# EAGLE design my_dac_amp (EAGLE 6.4)
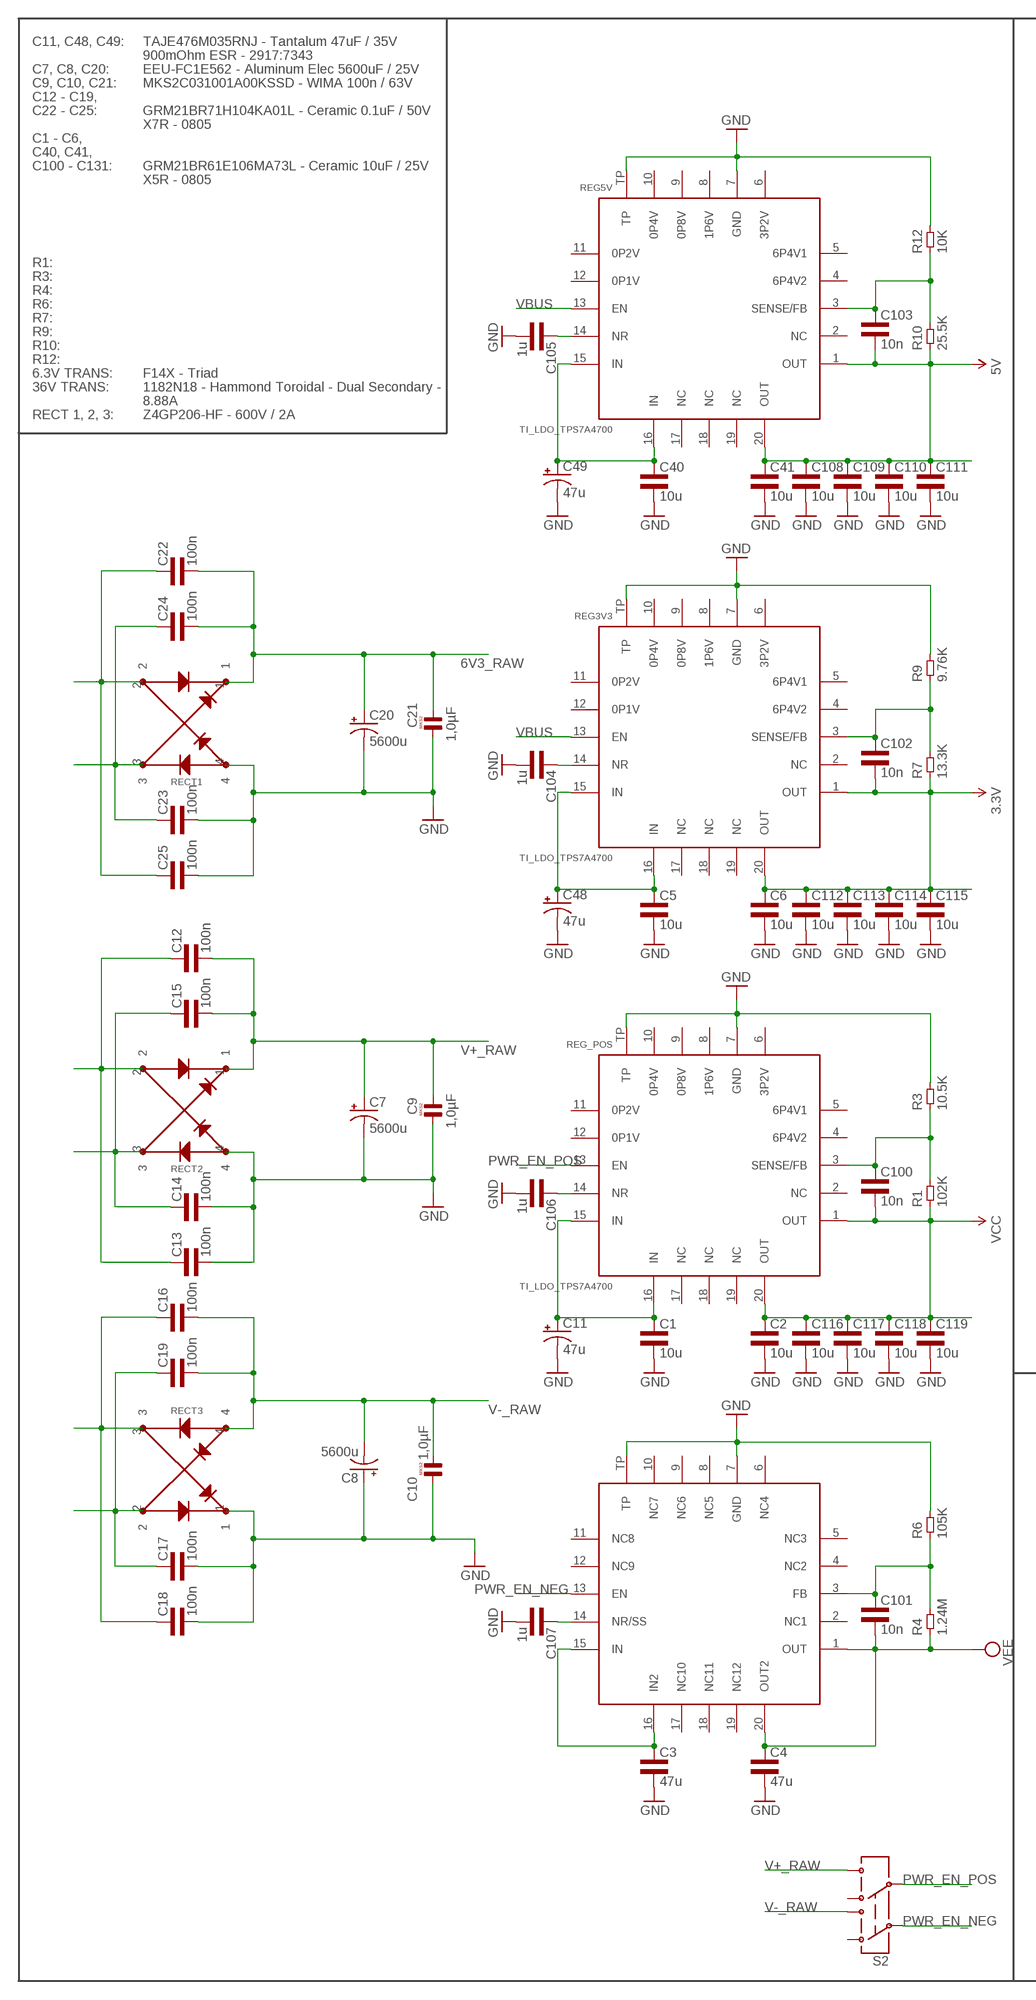
[diagram p0: schematic, sheet 1, part 1 of 2]
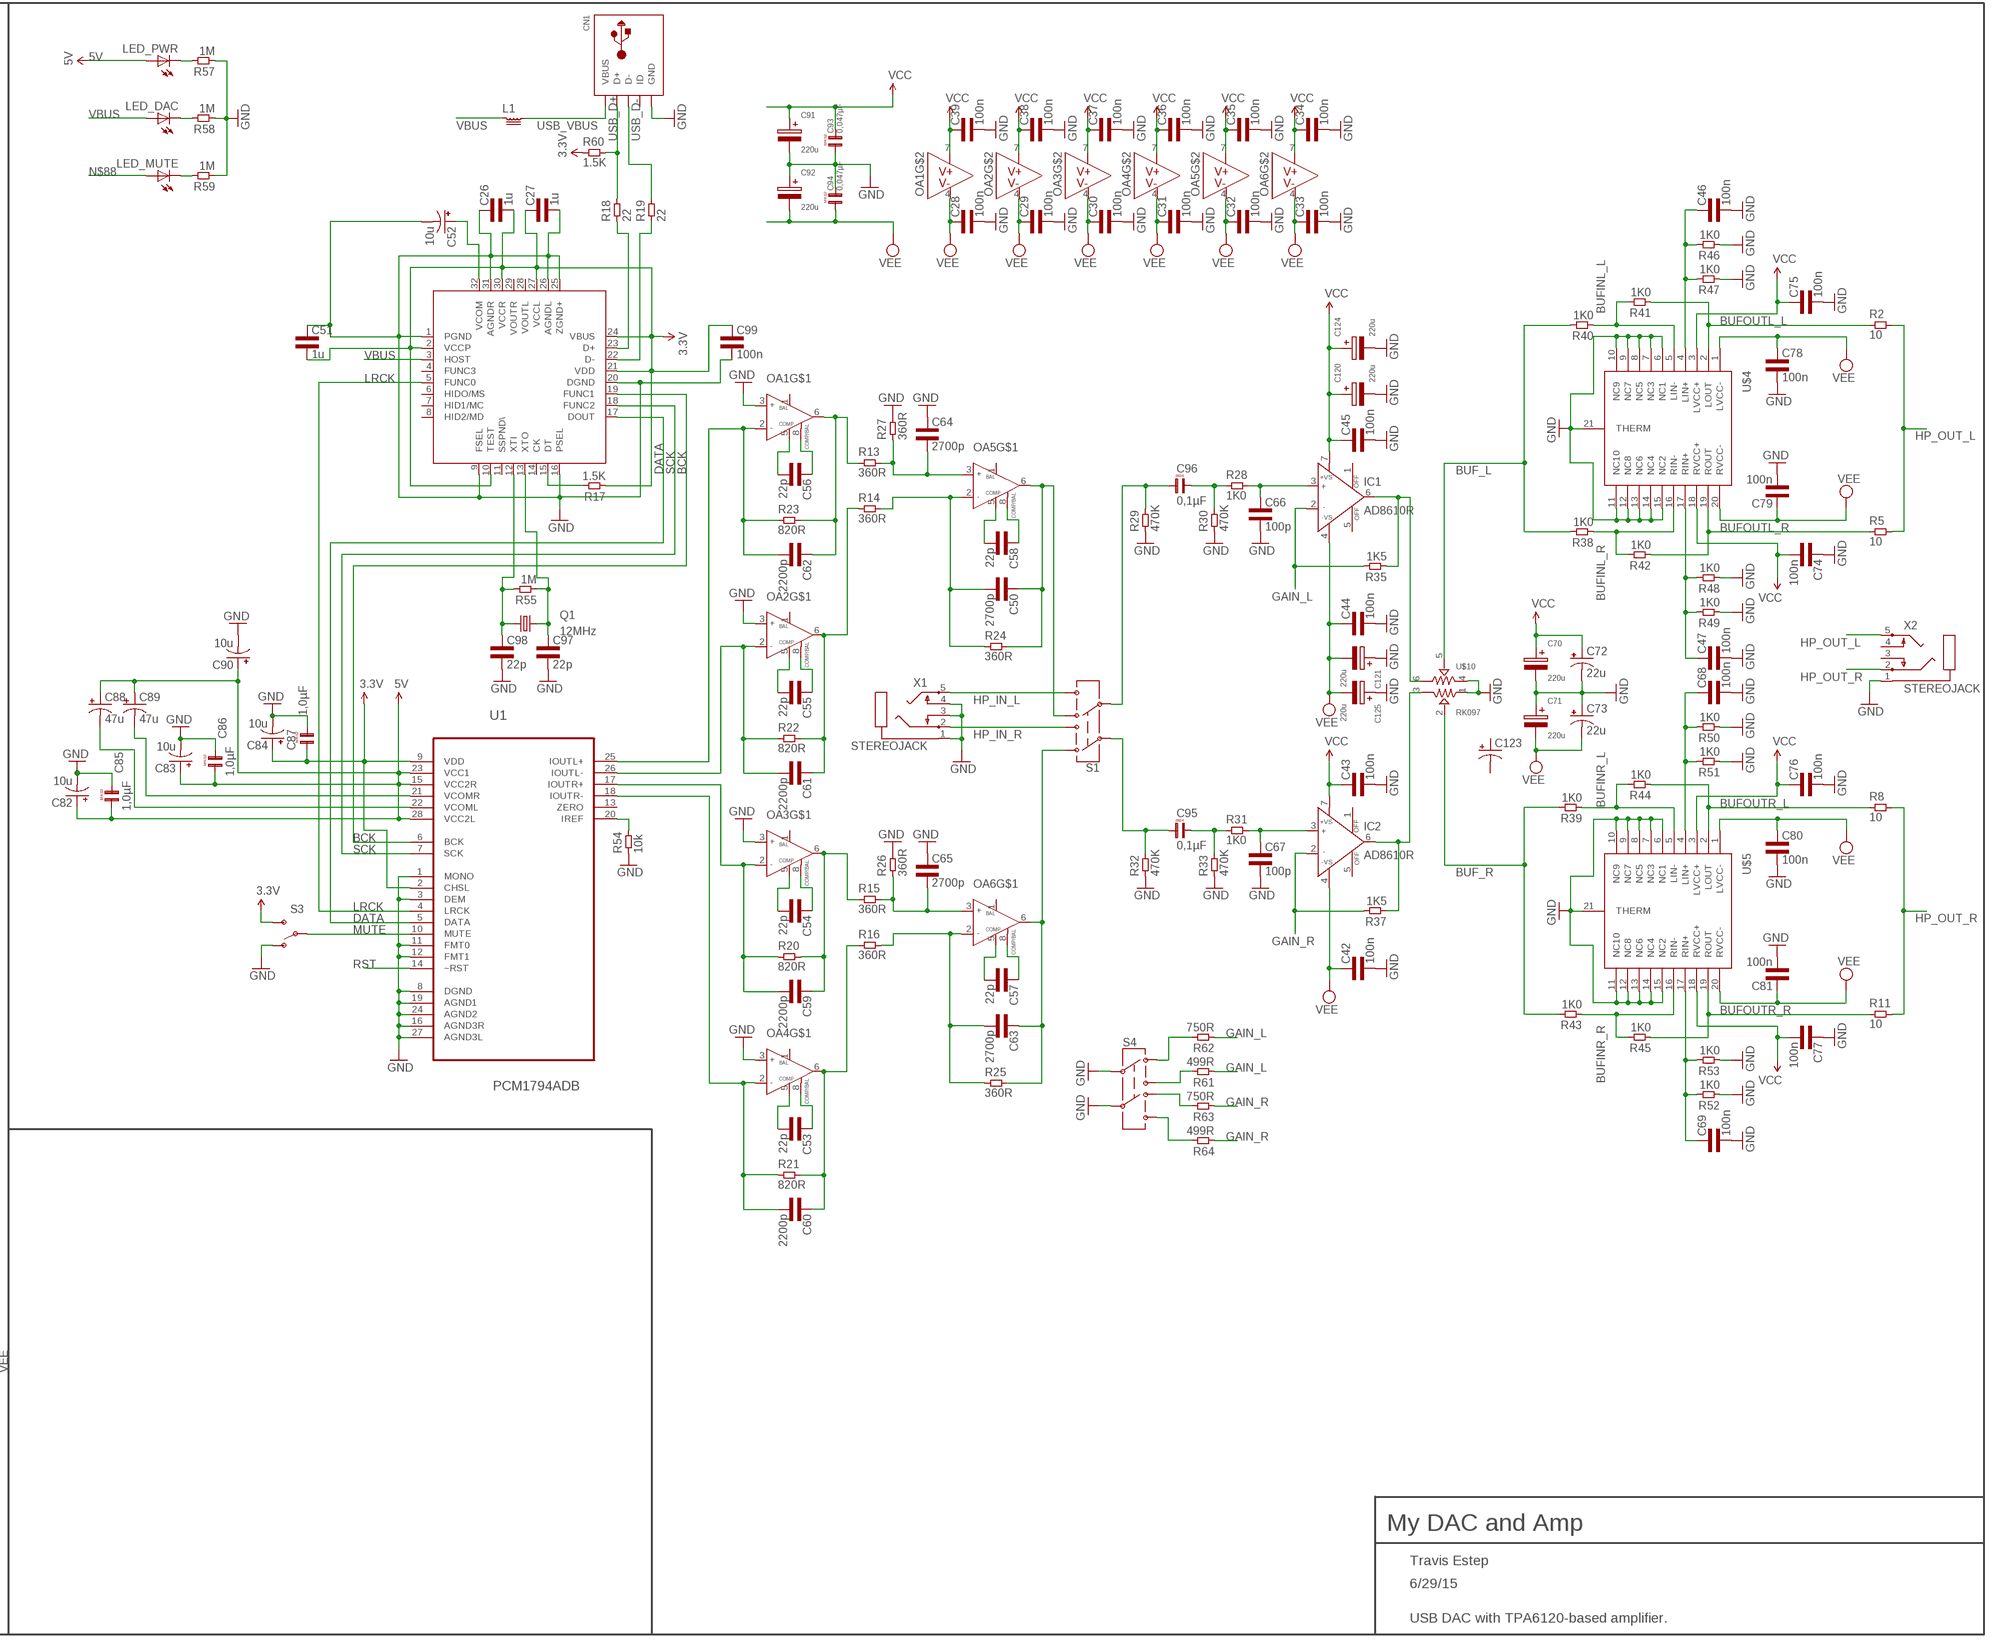
[diagram p1: schematic, sheet 1, part 2 of 2]

## Parts
C1  10u  CAP1206L3  [1206L3]
C2  10u  CAP0805L3  [0805L3]
C3  47u  CAP1206L3  [1206L3]
C4  47u  CAP1206L3  [1206L3]
C5  10u  CAP1206L3  [1206L3]
C6  10u  CAP0805L3  [0805L3]
C7  5600u  CPOL-USE7.5-16  [E7,5-16]
C8  5600u  CPOL-USE7.5-16  [E7,5-16]
C9  1,0µF  [R5B5]
C10  1,0µF  [R5B5]
C11  47u  CPOL-USSMCE  [SMC_E]
C12  100n  CAP0805L3  [0805L3]
C13  100n  CAP0805L3  [0805L3]
C14  100n  CAP0805L3  [0805L3]
C15  100n  CAP0805L3  [0805L3]
C16  100n  CAP0805L3  [0805L3]
C17  100n  CAP0805L3  [0805L3]
C18  100n  CAP0805L3  [0805L3]
C19  100n  CAP0805L3  [0805L3]
C20  5600u  CPOL-USE7.5-16  [E7,5-16]
C21  1,0µF  [R5B5]
C22  100n  CAP0805L3  [0805L3]
C23  100n  CAP0805L3  [0805L3]
C24  100n  CAP0805L3  [0805L3]
C25  100n  CAP0805L3  [0805L3]
C26  1u  CAP0603L3  [0603L3]
C27  1u  CAP0603L3  [0603L3]
C28  100n  CAP0603L3  [0603L3]
C29  100n  CAP0603L3  [0603L3]
C30  100n  CAP0603L3  [0603L3]
C31  100n  CAP0603L3  [0603L3]
C32  100n  CAP0603L3  [0603L3]
C33  100n  CAP0603L3  [0603L3]
C34  100n  CAP0603L3  [0603L3]
C35  100n  CAP0603L3  [0603L3]
C36  100n  CAP0603L3  [0603L3]
C37  100n  CAP0603L3  [0603L3]
C38  100n  CAP0603L3  [0603L3]
C39  100n  CAP0603L3  [0603L3]
C40  10u  CAP1206L3  [1206L3]
C41  10u  CAP0805L3  [0805L3]
C42  100n  CAP0603L3  [0603L3]
C43  100n  CAP0603L3  [0603L3]
C44  100n  CAP0603L3  [0603L3]
C45  100n  CAP0603L3  [0603L3]
C46  100n  CAP0603L3  [0603L3]
C47  100n  CAP0603L3  [0603L3]
C48  47u  CPOL-USSMCE  [SMC_E]
C49  47u  CPOL-USSMCE  [SMC_E]
C50  2700p  CAP0603L3  [0603L3]
C51  1u  CAP0603L3  [0603L3]
C52  10u  CPOL-USE3.5-8  [E3,5-8]
C53  22p  CAP0603L3  [0603L3]
C54  22p  CAP0603L3  [0603L3]
C55  22p  CAP0603L3  [0603L3]
C56  22p  CAP0603L3  [0603L3]
C57  22p  CAP0603L3  [0603L3]
C58  22p  CAP0603L3  [0603L3]
C59  2200p  CAP0603L3  [0603L3]
C60  2200p  CAP0603L3  [0603L3]
C61  2200p  CAP0603L3  [0603L3]
C62  2200p  CAP0603L3  [0603L3]
C63  2700p  CAP0603L3  [0603L3]
C64  2700p  CAP0603L3  [0603L3]
C65  2700p  CAP0603L3  [0603L3]
C66  100p  CAP0603L3  [0603L3]
C67  100p  CAP0603L3  [0603L3]
C68  100n  CAP0603L3  [0603L3]
C69  100n  CAP0603L3  [0603L3]
C70  220u  CAP_POL8066M  [8066M]
C71  220u  CAP_POL8066M  [8066M]
C72  22u  CPOL-USCT6032  [CT6032]
C73  22u  CPOL-USCT6032  [CT6032]
C74  100n  CAP0603L3  [0603L3]
C75  100n  CAP0603L3  [0603L3]
C76  100n  CAP0603L3  [0603L3]
C77  100n  CAP0603L3  [0603L3]
C78  100n  CAP0603L3  [0603L3]
C79  100n  CAP0603L3  [0603L3]
C80  100n  CAP0603L3  [0603L3]
C81  100n  CAP0603L3  [0603L3]
C82  10u  CPOL-USA/3216-18W  [A/3216-18W]
C83  10u  CPOL-USA/3216-18W  [A/3216-18W]
C84  10u  CPOL-USA/3216-18W  [A/3216-18W]
C85  1,0µF  [R5B5]
C86  1,0µF  [R5B5]
C87  1,0µF  [R5B5]
C88  47u  CPOL-USB/3528-21R  [B/3528-21R]
C89  47u  CPOL-USB/3528-21R  [B/3528-21R]
C90  10u  CPOL-USA/3216-18W  [A/3216-18W]
C91  220u  CAP_POL8066M  [8066M]
C92  220u  CAP_POL8066M  [8066M]
C93  0,047µF  [R5B2K5]
C94  0,047µF  [R5B2K5]
C95  0,1µF  [L7,2]
C96  0,1µF  [L7,2]
C97  22p  CAP0603L3  [0603L3]
C98  22p  CAP0603L3  [0603L3]
C99  100n  CAP0603L3  [0603L3]
C100  10n  CAP0603L3  [0603L3]
C101  10n  CAP0603L3  [0603L3]
C102  10n  CAP0603L3  [0603L3]
C103  10n  CAP0603L3  [0603L3]
C104  1u  CAP0603L3  [0603L3]
C105  1u  CAP0603L3  [0603L3]
C106  1u  CAP0603L3  [0603L3]
C107  1u  CAP0603L3  [0603L3]
C108  10u  CAP0805L3  [0805L3]
C109  10u  CAP0805L3  [0805L3]
C110  10u  CAP0805L3  [0805L3]
C111  10u  CAP0805L3  [0805L3]
C112  10u  CAP0805L3  [0805L3]
C113  10u  CAP0805L3  [0805L3]
C114  10u  CAP0805L3  [0805L3]
C115  10u  CAP0805L3  [0805L3]
C116  10u  CAP0805L3  [0805L3]
C117  10u  CAP0805L3  [0805L3]
C118  10u  CAP0805L3  [0805L3]
C119  10u  CAP0805L3  [0805L3]
C120  220u  CAP_POL8066M  [8066M]
C121  220u  CAP_POL8066M  [8066M]
C123  CPOL-USE/7260-38R  [E/7260-38R]
C124  220u  CAP_POL8066M  [8066M]
C125  220u  CAP_POL8066M  [8066M]
CN1  USBMINIB  [USB-MINIB]
IC1  AD8610R  [SO8]
IC2  AD8610R  [SO8]
L1  SRP4020  [4440]
LED_DAC  LED3MM  [LED3MM]
LED_MUTE  LED3MM  [LED3MM]
LED_PWR  LED3MM  [LED3MM]
OA1  NE5534ADSOIC8  [SOIC-8]
OA2  NE5534ADSOIC8  [SOIC-8]
OA3  NE5534ADSOIC8  [SOIC-8]
OA4  NE5534ADSOIC8  [SOIC-8]
OA5  NE5534ADSOIC8  [SOIC-8]
OA6  NE5534ADSOIC8  [SOIC-8]
Q1  12MHz  SPARKFUN_CRYSTALHC49US  [SPARKFUN_HC49US]
R1  102K  RES0603L3  [0603L3]
R2  10  RES1210L3  [1210L3]
R3  10.5K  RES0603L3  [0603L3]
R4  1.24M  RES0603L3  [0603L3]
R5  10  RES1210L3  [1210L3]
R6  105K  RES0603L3  [0603L3]
R7  13.3K  RES0603L3  [0603L3]
R8  10  RES1210L3  [1210L3]
R9  9.76K  RES0603L3  [0603L3]
R10  25.5K  RES0603L3  [0603L3]
R11  10  RES1210L3  [1210L3]
R12  10K  RES0603L3  [0603L3]
R13  360R  RES0603L3  [0603L3]
R14  360R  RES0603L3  [0603L3]
R15  360R  RES0603L3  [0603L3]
R16  360R  RES0603L3  [0603L3]
R17  1.5K  RES0603L3  [0603L3]
R18  22  RES0603L3  [0603L3]
R19  22  RES0603L3  [0603L3]
R20  820R  RES0603L3  [0603L3]
R21  820R  RES0603L3  [0603L3]
R22  820R  RES0603L3  [0603L3]
R23  820R  RES0603L3  [0603L3]
R24  360R  RES0603L3  [0603L3]
R25  360R  RES0603L3  [0603L3]
R26  360R  RES0603L3  [0603L3]
R27  360R  RES0603L3  [0603L3]
R28  1K0  RES0603L3  [0603L3]
R29  470K  RES0603L3  [0603L3]
R30  470K  RES0603L3  [0603L3]
R31  1K0  RES0603L3  [0603L3]
R32  470K  RES0603L3  [0603L3]
R33  470K  RES0603L3  [0603L3]
R35  1K5  RES0603L3  [0603L3]
R37  1K5  RES0603L3  [0603L3]
R38  1K0  RES0603L3  [0603L3]
R39  1K0  RES0603L3  [0603L3]
R40  1K0  RES0603L3  [0603L3]
R41  1K0  RES0603L3  [0603L3]
R42  1K0  RES0603L3  [0603L3]
R43  1K0  RES0603L3  [0603L3]
R44  1K0  RES0603L3  [0603L3]
R45  1K0  RES0603L3  [0603L3]
R46  1K0  RES0603L3  [0603L3]
R47  1K0  RES0603L3  [0603L3]
R48  1K0  RES0603L3  [0603L3]
R49  1K0  RES0603L3  [0603L3]
R50  1K0  RES0603L3  [0603L3]
R51  1K0  RES0603L3  [0603L3]
R52  1K0  RES0603L3  [0603L3]
R53  1K0  RES0603L3  [0603L3]
R54  10k  RES0603L3  [0603L3]
R55  1M  RES0603L3  [0603L3]
R57  1M  RES0603L3  [0603L3]
R58  1M  RES0603L3  [0603L3]
R59  1M  RES0603L3  [0603L3]
R60  1.5K  RES0603L3  [0603L3]
R61  499R  RES0603L3  [0603L3]
R62  750R  RES0603L3  [0603L3]
R63  750R  RES0603L3  [0603L3]
R64  499R  RES0603L3  [0603L3]
RECT1  Z4GP206  [ABS-4]
RECT2  Z4GP206  [ABS-4]
RECT3  Z4GP206  [ABS-4]
REG3V3  TI_LDO_TPS7A4700  [TI_LDO_VQFN-20]
REG5V  TI_LDO_TPS7A4700  [TI_LDO_VQFN-20]
REG_NEG  TI_LDO_TPS7A3301RGWT  [TI_LDO_VQFN-20]
REG_POS  TI_LDO_TPS7A4700  [TI_LDO_VQFN-20]
S1  SWITCH-DPDTOS  [OS]
S2  SWITCH-DPDTOS  [OS]
S3  SWITCH-SPDTKIT  [SWITCH-SPDT_KIT]
S4  SWITCH-DPDTOS  [OS]
U1  PCM1794ADB  [SOP65P780X200-28N]
U$3  PCM2704C_PCM2707  [PCM2704C_PCM2707]
U$4  AMP_TPA6120_TPA6120  [AMP_TPA6120_TPA6120]
U$5  AMP_TPA6120_TPA6120  [AMP_TPA6120_TPA6120]
U$10  RK097  [RK097]
X1  STEREOJACK  [STX3100]
X2  STEREOJACK  [STX3100]

## Nets
3.3V: C6.1 C26.P$2 C27.P$1 C51.P$2 C84.+ C87.1 C99.P$1 C102.P$2 C112.1 C113.1 C114.1 C115.1 R7.P$1 R17.P$1 R60.P$1 REG3V3.1(OUT) REG3V3.20(OUT) S3.3(S) U1.2(CHSL) U1.9(VDD) U$3.2(VCCP) U$3.10(TEST) U$3.21(VDD) U$3.24(VBUS) U$3.27(VCCL) U$3.30(VCCR)
5V: C41.1 C82.+ C83.+ C85.1 C86.1 C88.+ C89.+ C90.+ C103.P$2 C108.1 C109.1 C110.1 C111.1 LED_PWR.A R10.P$1 REG5V.1(OUT) REG5V.20(OUT) U1.15(VCC2R) U1.23(VCC1) U1.28(VCC2L)
6V3_RAW: C5.1 C20.+ C21.2 C22.2 C24.2 C40.1 C48.+ C49.+ RECT1.1 REG3V3.15(IN) REG3V3.16(IN) REG5V.15(IN) REG5V.16(IN)
AMP_CAP_L: C96.P$2 R28.P$1 R30.P$2
AMP_CAP_R: C95.P$2 R31.P$1 R33.P$2
AMP_IN_L: C66.P$1 IC1.3(IN+) R28.P$2
AMP_IN_R: C67.P$1 IC2.3(IN+) R31.P$2
AMP_L: C96.P$1 R29.P$2 S1.5
AMP_OUT_L: IC1.6(OUT) R35.P$1 U$10.6
AMP_OUT_R: IC2.6(OUT) R37.P$1 U$10.3
AMP_R: C95.P$1 R32.P$2 S1.2
BCK: U1.6(BCK) U$3.19(FUNC1)
BUF_L: R38.P$2 R40.P$2 U$10.5
BUF_R: R39.P$2 R43.P$2 U$10.2
BUFINL_L: R40.P$1 R41.P$2 U$4.5(LIN-)
BUFINL_R: R38.P$1 R42.P$2 U$4.16(RIN-)
BUFINR_L: R39.P$1 R44.P$2 U$5.5(LIN-)
BUFINR_R: R43.P$1 R45.P$2 U$5.16(RIN-)
BUFL_L+: C46.P$1 R46.P$2 R47.P$2 U$4.4(LIN+)
BUFL_R+: C47.P$1 R48.P$2 R49.P$2 U$4.17(RIN+)
BUFOUTL_L: R2.P$1 R41.P$1 U$4.2(LOUT)
BUFOUTL_R: R5.P$1 R42.P$1 U$4.19(ROUT)
BUFOUTR_L: R8.P$1 R44.P$1 U$5.2(LOUT)
BUFOUTR_R: R11.P$1 R45.P$1 U$5.19(ROUT)
BUFR_L+: C68.P$1 R50.P$2 R51.P$2 U$5.4(LIN+)
BUFR_R+: C69.P$1 R52.P$2 R53.P$2 U$5.17(RIN+)
D+: R18.P$1 U$3.23(D+)
D-: R19.P$1 U$3.22(D-)
DATA: U1.5(DATA) U$3.17(DOUT)
GAIN_L: IC1.2(IN-) R35.P$2 R61.P$1 R62.P$1
GAIN_R: IC2.2(IN-) R37.P$2 R63.P$1 R64.P$1
GAINL_1: R62.P$2 S4.1
GAINL_2: R61.P$2 S4.3
GAINR_1: R63.P$2 S4.4
GAINR_2: R64.P$2 S4.6
GND: C1.2 C2.2 C3.2 C4.2 C5.2 C6.2 C7.- C8.+ C9.1 C10.1 C11.- C13.2 C14.2 C17.2 C18.2 C20.- C21.1 C23.2 C25.2 C26.P$1 C27.P$2 C28.P$2 C29.P$2 C30.P$2 C31.P$2 C32.P$2 C33.P$2 C34.P$2 C35.P$2 C36.P$2 C37.P$2 C38.P$2 C39.P$2 C40.2 C41.2 C42.P$2 C43.P$2 C44.P$2 C45.P$2 C46.P$2 C47.P$2 C48.- C49.- C51.P$1 C52.- C64.P$1 C65.P$1 C66.P$2 C67.P$2 C68.P$2 C69.P$2 C70.2 C71.1 C72.- C73.+ C74.P$1 C75.P$2 C76.P$2 C77.P$1 C78.P$2 C79.P$2 C80.P$2 C81.P$2 C82.- C83.- C84.- C85.2 C86.2 C87.2 C90.- C91.2 C92.1 C93.1 C94.2 C97.P$2 C98.P$2 C99.P$2 C104.P$2 C105.P$2 C106.P$2 C107.P$2 C108.2 C109.2 C110.2 C111.2 C112.2 C113.2 C114.2 C115.2 C116.2 C117.2 C118.2 C119.2 C120.2 C121.1 C124.2 C125.1 CN1.GND OA1.3(IN+) OA2.3(IN+) OA3.3(IN+) OA4.3(IN+) R3.P$2 R6.P$2 R9.P$2 R12.P$2 R26.P$2 R27.P$2 R29.P$1 R30.P$1 R32.P$1 R33.P$1 R46.P$1 R47.P$1 R48.P$1 R49.P$1 R50.P$1 R51.P$1 R52.P$1 R53.P$1 R54.P$1 R57.P$1 R58.P$1 R59.P$1 RECT1.4 RECT2.4 RECT3.1 REG3V3.7(GND) REG3V3.TP REG5V.7(GND) REG5V.TP REG_NEG.7(GND) REG_NEG.TP REG_POS.7(GND) REG_POS.TP S3.1(O) S4.2 S4.5 U1.1(MONO) U1.3(DEM) U1.8(DGND) U1.11(FMT0) U1.12(FMT1) U1.16(AGND3R) U1.19(AGND1) U1.24(AGND2) U1.27(AGND3L) U$3.1(PGND) U$3.9(FSEL) U$3.16(PSEL) U$3.20(DGND) U$3.25(ZGND+) U$3.26(AGNDL) U$3.31(AGNDR) U$4.6(NC1) U$4.7(NC3) U$4.8(NC5) U$4.9(NC7) U$4.10(NC9) U$4.11(NC10) U$4.12(NC8) U$4.13(NC6) U$4.14(NC4) U$4.15(NC2) U$4.21(THERM) U$5.6(NC1) U$5.7(NC3) U$5.8(NC5) U$5.9(NC7) U$5.10(NC9) U$5.11(NC10) U$5.12(NC8) U$5.13(NC6) U$5.14(NC4) U$5.15(NC2) U$5.21(THERM) U$10.1 U$10.4 X1.1 X1.3 X1.4 X2.1
HP_IN_L: S1.6 X1.5
HP_IN_R: S1.3 X1.2
HP_OUT_L: R2.P$2 R5.P$2 X2.5
HP_OUT_R: R8.P$2 R11.P$2 X2.2
IOUTL+: C62.P$2 OA1.2(IN-) R23.P$1 U1.25(IOUTL+)
IOUTL-: C61.P$2 OA2.2(IN-) R22.P$1 U1.26(IOUTL-)
IOUTR+: C59.P$2 OA3.2(IN-) R20.P$1 U1.17(IOUTR+)
IOUTR-: C60.P$2 OA4.2(IN-) R21.P$1 U1.18(IOUTR-)
IVOUT_L-: C61.P$1 OA2.6(OUT) R14.P$1 R22.P$2
IVOUT_R-: C60.P$1 OA4.6(OUT) R16.P$1 R21.P$2
IVOUTR+: C59.P$1 OA3.6(OUT) R15.P$1 R20.P$2
IVUOT_L+: C62.P$1 OA1.6(OUT) R13.P$1 R23.P$2
LRCK: U1.4(LRCK) U$3.5(FUNC0)
MUTE: S3.2(P) U1.10(MUTE)
N$1: C103.P$1 R10.P$2 R12.P$1 REG5V.3(SENSE/FB)
N$2: C100.P$1 R1.P$2 R3.P$1 REG_POS.3(SENSE/FB)
N$4: LED_PWR.K(C) R57.P$2
N$5: LED_DAC.K(C) R58.P$2
N$7: C101.P$1 R4.P$2 R6.P$1 REG_NEG.3(FB)
N$12: C12.1 C13.1 RECT2.2
N$13: C14.1 C15.1 RECT2.3
N$17: C102.P$1 R7.P$2 R9.P$1 REG3V3.3(SENSE/FB)
N$23: C23.1 C24.1 RECT1.3
N$24: C22.1 C25.1 RECT1.2
N$32: C52.+ U$3.32(VCOM)
N$33: R17.P$2 U$3.15(DT)
N$51: C107.P$1 REG_NEG.14(NR/SS)
N$52: C106.P$1 REG_POS.14(NR)
N$54: C104.P$1 REG3V3.14(NR)
N$55: C105.P$1 REG5V.14(NR)
N$72: C16.1 C18.1 RECT3.3
N$77: C17.1 C19.1 RECT3.2
N$78: C89.- U1.21(VCOMR)
N$79: C88.- U1.22(VCOML)
N$80: C98.P$1 Q1.1 R55.P$2 U$3.12(XTI)
N$82: C97.P$1 Q1.2 R55.P$1 U$3.13(XTO)
N$83: LED_MUTE.K(C) R59.P$2
N$84: R54.P$2 U1.20(IREF)
N$88: LED_MUTE.A
OA1_COMP: C56.P$2 OA1.5(COMP)
OA1_COMPBAL: C56.P$1 OA1.8(COMP/BAL)
OA2_COMP: C55.P$2 OA2.5(COMP)
OA2_COMPBAL: C55.P$1 OA2.8(COMP/BAL)
OA3_COMP: C54.P$2 OA3.5(COMP)
OA3_COMPBAL: C54.P$1 OA3.8(COMP/BAL)
OA4_COMP: C53.P$2 OA4.5(COMP)
OA4_COMPBAL: C53.P$1 OA4.8(COMP/BAL)
OA5_COMP: C58.P$2 OA5.5(COMP)
OA5_COMPBAL: C58.P$1 OA5.8(COMP/BAL)
OA6_COMP: C57.P$2 OA6.5(COMP)
OA6_COMPBAL: C57.P$1 OA6.8(COMP/BAL)
PWR_EN_NEG: REG_NEG.13(EN) S2.2
PWR_EN_POS: REG_POS.13(EN) S2.5
RST: U1.14(~RST)
SCK: U1.7(SCK) U$3.18(FUNC2)
SEIN_L+: C64.P$2 OA5.3(IN+) R13.P$2 R27.P$1
SEIN_L-: C50.P$2 OA5.2(IN-) R14.P$2 R24.P$1
SEIN_R+: C65.P$2 OA6.3(IN+) R15.P$2 R26.P$1
SEIN_R-: C63.P$2 OA6.2(IN-) R16.P$2 R25.P$1
SEOUT_L: C50.P$1 OA5.6(OUT) R24.P$2 S1.4
SEOUT_R: C63.P$1 OA6.6(OUT) R25.P$2 S1.1
USB_D+: CN1.D+ R18.P$2 R60.P$2
USB_D-: CN1.D- R19.P$2
USB_VBUS: CN1.VBUS L1.2
V+_RAW: C1.1 C7.+ C9.2 C11.+ C12.2 C15.2 RECT2.1 REG_POS.15(IN) REG_POS.16(IN) S2.6
V-_RAW: C3.1 C8.- C10.2 C16.2 C19.2 RECT3.4 REG_NEG.15(IN) REG_NEG.16(IN2) S2.3
VBUS: L1.1 LED_DAC.A REG3V3.13(EN) REG5V.13(EN) U$3.3(HOST)
VCC: C2.1 C34.P$1 C35.P$1 C36.P$1 C37.P$1 C38.P$1 C39.P$1 C43.P$1 C45.P$1 C70.1 C72.+ C74.P$2 C75.P$1 C76.P$1 C77.P$2 C91.1 C93.2 C100.P$2 C116.1 C117.1 C118.1 C119.1 C120.1 C124.1 IC1.7(+VS) IC2.7(+VS) OA1.7(V+) OA2.7(V+) OA3.7(V+) OA4.7(V+) OA5.7(V+) OA6.7(V+) R1.P$1 REG_POS.1(OUT) REG_POS.20(OUT) U$4.3(LVCC+) U$4.18(RVCC+) U$5.3(LVCC+) U$5.18(RVCC+)
VEE: C4.1 C28.P$1 C29.P$1 C30.P$1 C31.P$1 C32.P$1 C33.P$1 C42.P$1 C44.P$1 C71.2 C73.- C78.P$1 C79.P$1 C80.P$1 C81.P$1 C92.2 C94.1 C101.P$2 C121.2 C125.2 IC1.4(-VS) IC2.4(-VS) OA1.4(V-) OA2.4(V-) OA3.4(V-) OA4.4(V-) OA5.4(V-) OA6.4(V-) R4.P$1 REG_NEG.1(OUT) REG_NEG.20(OUT2) U$4.1(LVCC-) U$4.20(RVCC-) U$5.1(LVCC-) U$5.20(RVCC-)
Unconnected: C123.+ C123.- CN1.ID IC1.1(OFF) IC1.5(OFF) IC2.1(OFF) IC2.5(OFF) OA1.1(BAL) OA2.1(BAL) OA3.1(BAL) OA4.1(BAL) OA5.1(BAL) OA6.1(BAL) REG3V3.2(NC) REG3V3.4(6P4V2) REG3V3.5(6P4V1) REG3V3.6(3P2V) REG3V3.8(1P6V) REG3V3.9(0P8V) REG3V3.10(0P4V) REG3V3.11(0P2V) REG3V3.12(0P1V) REG3V3.17(NC) REG3V3.18(NC) REG3V3.19(NC) REG5V.2(NC) REG5V.4(6P4V2) REG5V.5(6P4V1) REG5V.6(3P2V) REG5V.8(1P6V) REG5V.9(0P8V) REG5V.10(0P4V) REG5V.11(0P2V) REG5V.12(0P1V) REG5V.17(NC) REG5V.18(NC) REG5V.19(NC) REG_NEG.2(NC1) REG_NEG.4(NC2) REG_NEG.5(NC3) REG_NEG.6(NC4) REG_NEG.8(NC5) REG_NEG.9(NC6) REG_NEG.10(NC7) REG_NEG.11(NC8) REG_NEG.12(NC9) REG_NEG.17(NC10) REG_NEG.18(NC11) REG_NEG.19(NC12) REG_POS.2(NC) REG_POS.4(6P4V2) REG_POS.5(6P4V1) REG_POS.6(3P2V) REG_POS.8(1P6V) REG_POS.9(0P8V) REG_POS.10(0P4V) REG_POS.11(0P2V) REG_POS.12(0P1V) REG_POS.17(NC) REG_POS.18(NC) REG_POS.19(NC) S2.1 S2.4 U1.13(ZERO) U$3.4(FUNC3) U$3.6(HIDO/MS) U$3.7(HID1/MC) U$3.8(HID2/MD) U$3.11(SSPND\) U$3.14(CK) U$3.28(VOUTL) U$3.29(VOUTR) X2.3 X2.4

## Notes on the sheet
- C11, C48, C49: | TAJE476M035RNJ - Tantalum 47uF / 35V
- 900mOhm ESR - 2917:7343
- C7, C8, C20: | EEU-FC1E562 - Aluminum Elec 5600uF / 25V
- C9, C10, C21: | MKS2C031001A00KSSD - WIMA 100n / 63V
- C12 - C19,
- C22 - C25: | GRM21BR71H104KA01L - Ceramic 0.1uF / 50V
- X7R - 0805
- C1 - C6,
- C40, C41,
- C100 - C131: | GRM21BR61E106MA73L - Ceramic 10uF / 25V
- X5R - 0805
- R1:
- R3:
- R4:
- R6:
- R7:
- R9:
- R10:
- R12:
- 6.3V TRANS: | F14X - Triad
- 36V TRANS: | 1182N18 - Hammond Toroidal - Dual Secondary -
- 8.88A
- RECT 1, 2, 3: | Z4GP206-HF - 600V / 2A
- My DAC and Amp
- Travis Estep
- 6/29/15
- USB DAC with TPA6120-based amplifier.

## Library data of the parts
C1-C6 C12-C19 C22-C47 C50 C51 C53-C69 C74-C81 C97-C119 = common:CAP
C7 C8 C11 C20 C48 C49 C52 C72 C73 C82-C84 C88-C90 C123 = rcl:CPOL-US: POLARIZED CAPACITOR, American symbol
C9 C10 C21 = Capacitor-Wima-MKS2-63v:1,0µF
C70 C71 C91 C92 C120 C121 C124 C125 = common:CAP_POL
C85-C87 = Capacitor-Wima-MKS2-50v:1,0µF
C93 C94 = Capacitor-Wima-MKS2-63v:0,047µF
C95 C96 = Capacitor-Wima-SMD2824-63v:0,1µF
CN1 = adafruit:USB: USB Connectors USBMINIB - Surface Mount Female Mini-B USB Connector 4UConnector: 06564 By microbuilder.eu Thru-hole RA Female Mini-B USB Connector 4UConnector: 18732 By ladyada.net
IC1 IC2 = analog-devices:AD8610: Precision, Very Low Noise, Low Input Bias Current, Wide Bandwidth JFET Operational Amplifiers Source: http://www.analog.com/static/imported-files/data_sheets/AD8610_8620.pdf; MF: ALTERA CORPORATION; MPN: AD8610BRZ; OC_FARNELL: 8621578; OC_NEWARK: 59K6944
L1 = common:SRP4020
LED_DAC LED_MUTE LED_PWR = adafruit:LED: LED OSRAM: - CHIPLED LG R971, LG N971, LY N971, LG Q971, LY Q971, LO R971, LY R971 LH N974, LH R974 LS Q976, LO Q976, LY Q976 LO Q996 - Hyper CHIPLED LW Q18S LB Q993, LB Q99A, LB R99A - SideLED LS A670, LO A670, LY A670, LG A670, LP A670 LB A673, LV A673, LT A673, LW A673 LH A674 LY A675 LS A676, LA A676, LO A676, LY A676, LW A676 LS A679, LY A679, LG A679 - Hyper Micro SIDELED® LS Y876, LA Y876, LO Y876, LY Y876 LT Y87S - SmartLED LW L88C, LW L88S LB L89C, LB L89S, LG L890 LS L89K, LO L89K, LY L89K LS L896, LA L896, LO L896, LY L896 - TOPLED LS T670, LO T670, LY T670, LG T670, LP T670 LSG T670, LSP T670, LSY T670, LOP T670, LYG T670 LG T671, LOG T671, LSG T671 LB T673, LV T673, LT T673, LW T673 LH T674 LS T676, LA T676, LO T676, LY T676, LB T676, LH T676, LSB T676, LW T676 LB T67C, LV T67C, LT T67C, LS T67K, LO T67K, LY T67K, LW E67C LS E67B, LA E67B, LO E67B, LY E67B, LB E67C, LV E67C, LT E67C LW T67C LS T679, LY T679, LG T679 LS T770, LO T770, LY T770, LG T770, LP T770 LB T773, LV T773, LT T773, LW T773 LH T774 LS E675, LA E675, LY E675, LS T675 LS T776, LA T776, LO T776, LY T776, LB T776 LHGB T686 LT T68C, LB T68C - Hyper Mini TOPLED® LB M676 - Mini TOPLED Santana® LG M470 LS M47K, LO M47K, LY M47K Source: http://www.osram.convergy.de/
OA1-OA6 = common:NE5534: Low-noise, high-SP audio Op Amp.; BIAS_CURRENT: 500nA; CMRR: 100dB; GAIN_BANDWIDTH_PRODUCT: 10MHz; IN-VOL_NOISE_DENSITY: 3.5nV; OFFSET_VOL: 500uV; OUTPUT_CURRENT: 38mA; SLEW_RATE: 13V/uS; SUPPLY_CURRENT: 4mA; SUPPLY_VOL_MAX: 30V; SUPPLY_VOL_MIN: 10V
Q1 = pcm2707_v1:SPARKFUN_CRYSTAL: Crystals Various standard crystals. Proven footprints. Spark Fun Electronics SKU : COM-00534
R1-R33 R35 R37-R55 R57-R64 = common:RES
RECT1-RECT3 = rectifier:Z4GP206
REG3V3 REG5V REG_POS = power-supply_pos_v1:TI_LDO_TPS7A4700
REG_NEG = power-supply_pos_v1:TI_LDO_TPS7A3301RGWT: Ultra-Low Noise NEGATIVE Voltage Reglator
S1 S2 S4 = SparkFun-Electromechanical:SWITCH-DPDT: DPDT Version of the COM-00597
S3 = SparkFun-Electromechanical:SWITCH-SPDT: SPDT Switch Simple slide switch, Spark Fun Electronics SKU : COM-00102 DPDT SMT slide switch, AYZ0202, SWCH-08179
U1 = Texas Instruments_By_element14_Batch_1:PCM1794ADB: 24-Bit 192khz Sampling advanced segment Audio stereo digital-to-analog converter; MPN: PCM1794ADB; OC_FARNELL: 1755014; OC_NEWARK: 54K0199; PACKAGE: SSOP-28; SUPPLIER: Texas Instruments
U$3 = pcm2707_v1:PCM2704C_PCM2707: Upgraded version of the PCM2704. It allows connecting to a device with USB and transmitting that data to another DAC using I2S protocol. Also has other advanced features that allow control with SPI, external buttons, etc.
U$4 U$5 = pcm2707_v1:AMP_TPA6120_TPA6120
U$10 = SparkFun-Electromechanical:RK097
X1 X2 = adafruit:STEREOJACK: MIC/HEADPHONE JACK Stereo jack with two switches. Kycon STX3100, CUI SJ1-3555NG and/or 4UCon 05544

## Board
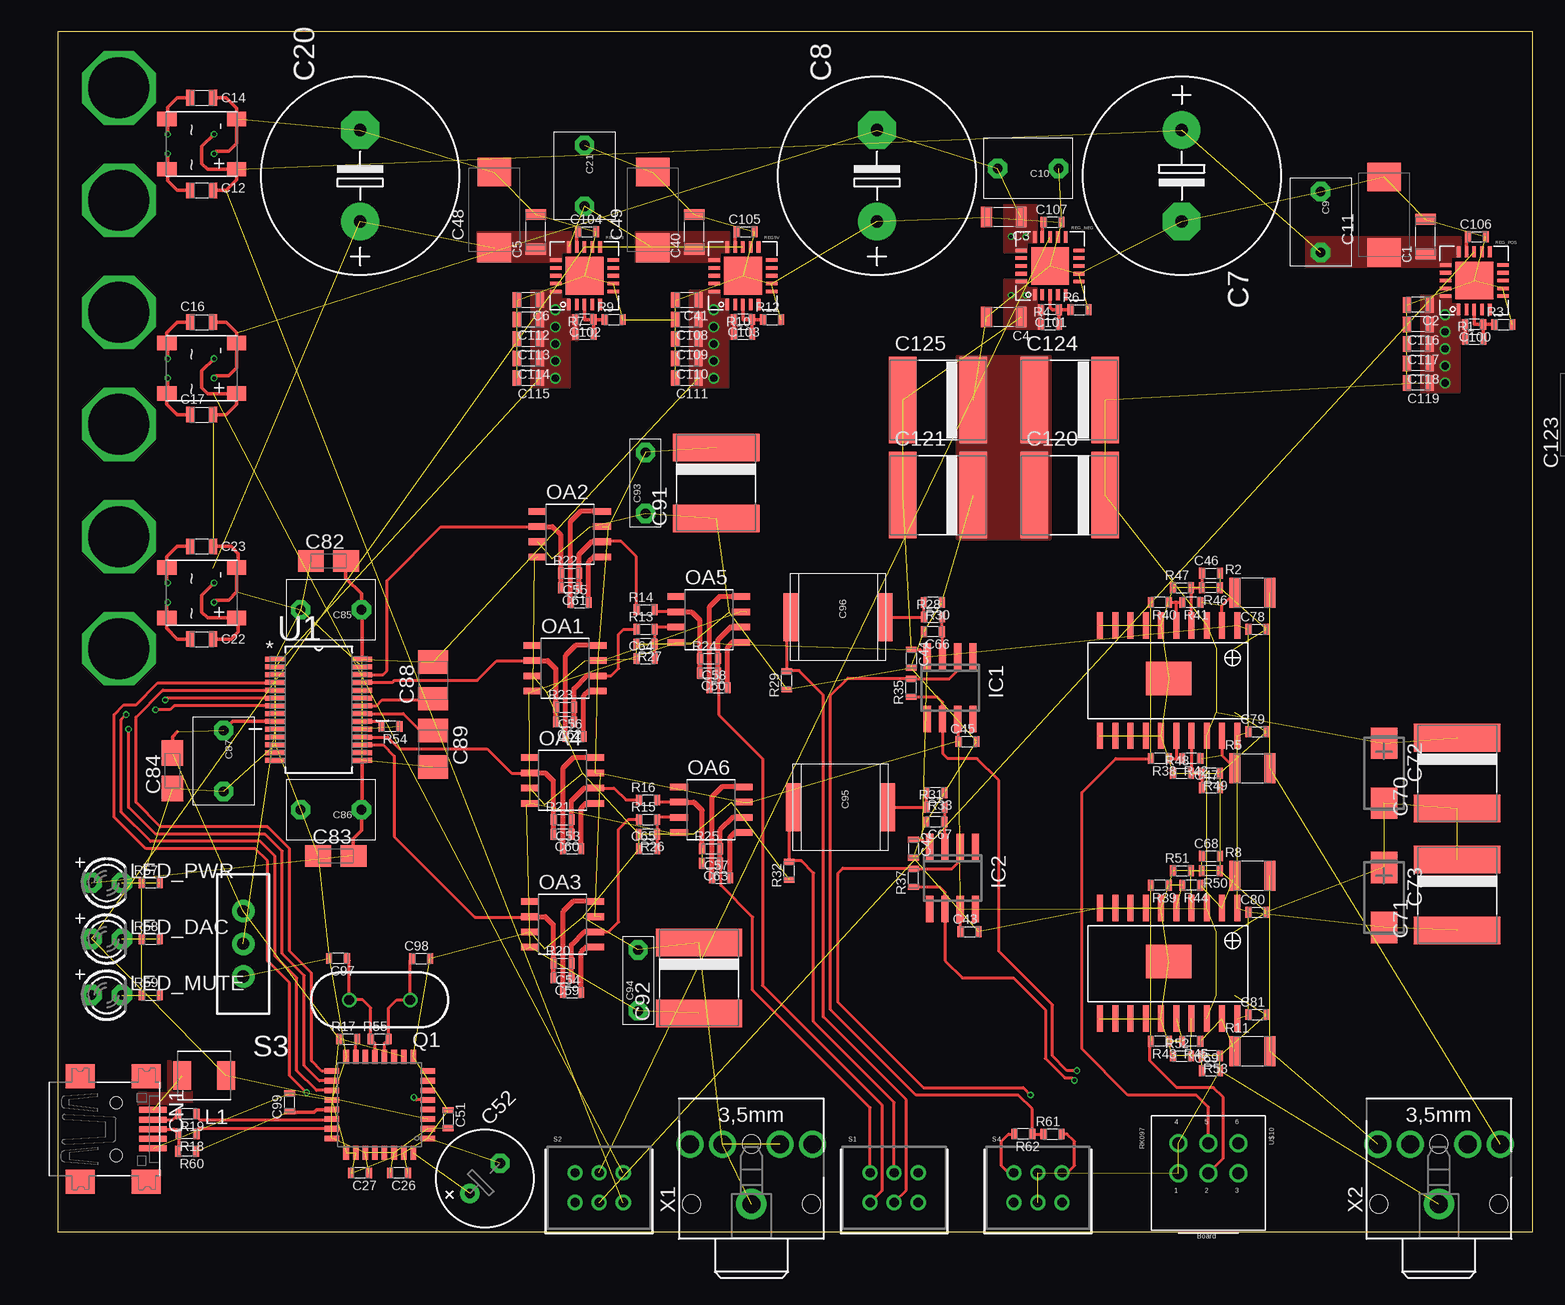
[diagram p2: board, top side]
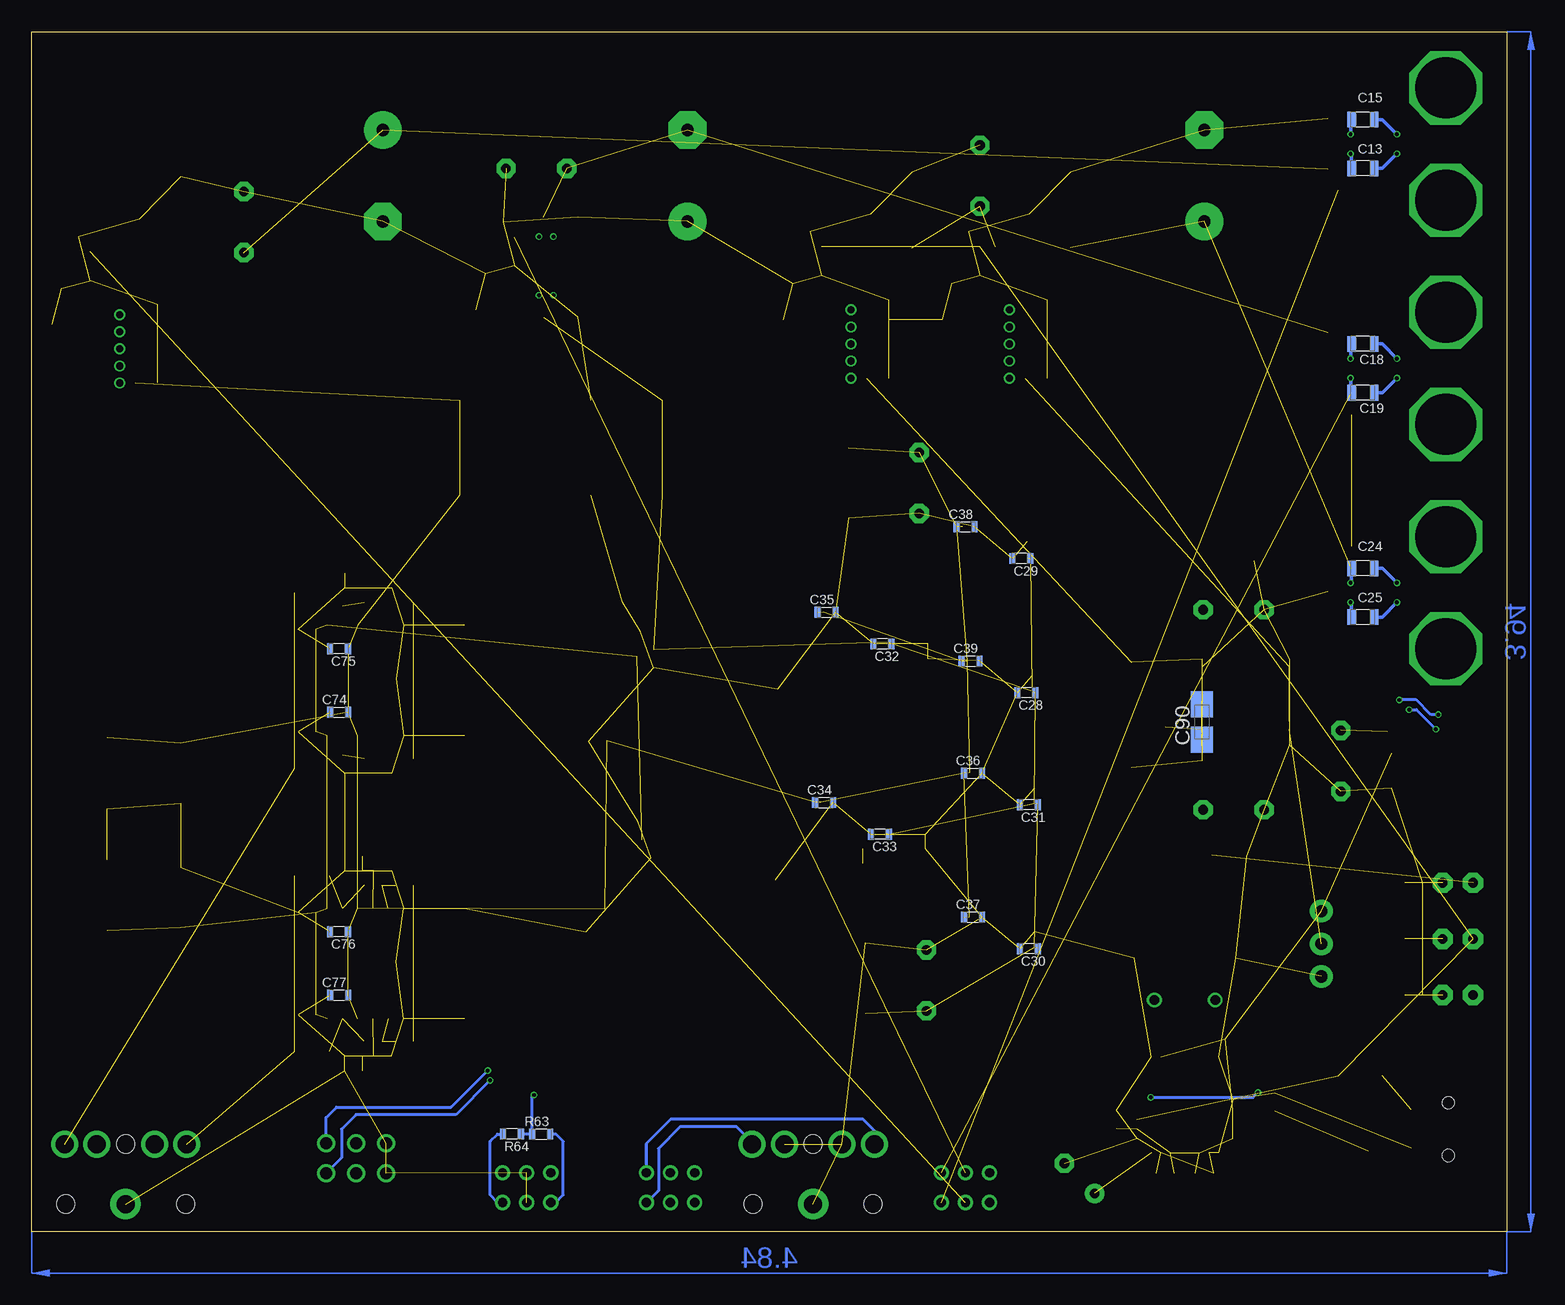
[diagram p3: board, bottom side, seen from below]

Size 122.94 x 100 mm. Coordinates in mm from the lower left corner, seen from the top.
Outline: 0,0 122.94,0 122.94,99.97 0,100 0,0
Copper layers (1*2*3*16): Top 0.035mm / dielectric 1.5mm / Route2 0.035mm / dielectric 0.15mm / Route3 0.035mm / dielectric 0.2mm / Bottom 0.035mm
Design rules "default *": minimum track width 5mil, minimum drill 10mil, track to track 5mil, track to pad 5mil, pad to pad 5mil, via to via 5mil, smd to smd 5mil, copper to edge 15mil, drill to drill 5mil, minimum pad ring 4mil, minimum via ring 4mil, stop-mask expansion 4mil, vias tented up to drill 14mil, thermal gap 10mil

### Footprints (pad centres in the part's own frame; a part is rotated, then mirrored left to right if it is on the bottom)
1206L3 = smd 0.9 x 1.7: 1 -1.45,0; 2 1.45,0
0805L3 = smd 0.7 x 1.3: 1 -0.95,0; 2 0.95,0
E7,5-16 = drill 1.016 pad 3.15: + -3.81,0 | drill 1.016 pad 3.15 octagon: - 3.81,0
R5B5 = drill 0.813 pad 1.6 octagon: 1 -2.54,0; 2 2.54,0
SMC_E = smd 2.4 x 2.8: + -3.15,0; - 3.15,0
0603L3 = smd 0.5 x 0.9: P$1 -0.75,0; P$2 0.75,0
E3,5-8 = drill 0.813 pad 1.6: + -1.778,0 | drill 0.813 pad 1.6 octagon: - 1.778,0
8066M = smd 7.2 x 2.3: 1 0,2.95; 2 0,-2.95
CT6032 = smd 2.6 x 2.2: + -2.5,0; - 2.5,0
A/3216-18W = smd 2.15 x 1.8: + 1.475,0; - -1.475,0
B/3528-21R = smd 1.95 x 2.5: + 1.525,0; - -1.525,0
R5B2K5 = drill 0.813 pad 1.6 octagon: 1 -2.54,0; 2 2.54,0
L7,2 = smd 4 x 1.2: P$1 0,-3.95; P$2 0,3.95
E/7260-38R = smd 2.55 x 4.4: + 3.175,0; - -3.175,0
USB-MINIB = smd 0.5 x 2.308: D+ 0,4.064; D- -0.8,4.064; GND 1.6,4.064; ID 0.8,4.064; VBUS -1.6,4.064 | smd 2 x 2.4: GND1 -4.4,-2; GND2 -4.4,3.5; GND3 4.4,3.5; GND4 4.4,-2 | hole 1: -2.2,1; 2.2,1
SO8 = smd 0.6 x 2.2: 1 -1.905,-2.6; 2 -0.635,-2.6; 3 0.635,-2.6; 4 1.905,-2.6; 5 1.905,2.6; 6 0.635,2.6; 7 -0.635,2.6; 8 -1.905,2.6
4440 = smd 1.5 x 2.4: 1 -1.85,0; 2 1.85,0
LED3MM = drill 0.813 pad 1.676 octagon: A -1.27,0; K 1.27,0
SOIC-8 = smd 0.55 x 1.5: 1 -1.905,-2.7; 2 -0.635,-2.7; 3 0.635,-2.7; 4 1.905,-2.7; 5 1.905,2.7; 6 0.635,2.7; 7 -0.635,2.7; 8 -1.905,2.7
SPARKFUN_HC49US = drill 0.813: 1 -2.54,0; 2 2.54,0
1210L3 = smd 0.9 x 2.5: P$1 -1.45,0; P$2 1.45,0
ABS-4 = smd 1.2 x 1.6: 1 2.1,2.91; 2 2.1,-2.91; 3 -2.1,-2.91; 4 -2.1,2.91
TI_LDO_VQFN-20 = smd 0.3 x 0.95: 1 -1.3,-2.4; 2 -0.65,-2.4; 3 0,-2.4; 4 0.65,-2.4; 5 1.3,-2.4; 11 1.3,2.4; 12 0.65,2.4; 13 0,2.4; 14 -0.65,2.4; 15 -1.3,2.4 | smd 0.95 x 0.3: 6 2.4,-1.3; 7 2.4,-0.65; 8 2.4,0; 9 2.4,0.65; 10 2.4,1.3; 16 -2.4,1.3; 17 -2.4,0.65; 18 -2.4,0; 19 -2.4,-0.65; 20 -2.4,-1.3 | smd 3.15 x 3.15: TP 0,0
OS = drill 0.787 pad 1.27: 1 -2.007,1.245; 2 0,1.245; 3 2.007,1.245; 4 -2.007,-1.245; 5 0,-1.245; 6 2.007,-1.245
SWITCH-SPDT_KIT = drill 1.016 pad 1.88: 1 0,2.718; 2 0,0; 3 0,-2.718
SOP65P780X200-28N = smd 1.651 x 0.432: 1 -3.632,4.216; 2 -3.632,3.581; 3 -3.632,2.921; 4 -3.632,2.286; 5 -3.632,1.626; 6 -3.632,0.965; 7 -3.632,0.33; 8 -3.632,-0.33; 9 -3.632,-0.965; 10 -3.632,-1.626; 11 -3.632,-2.286; 12 -3.632,-2.921; 13 -3.632,-3.581; 14 -3.632,-4.216; 15 3.632,-4.216; 16 3.632,-3.581; 17 3.632,-2.921; 18 3.632,-2.286; 19 3.632,-1.626; 20 3.632,-0.965; 21 3.632,-0.33; 22 3.632,0.33; 23 3.632,0.965; 24 3.632,1.626; 25 3.632,2.286; 26 3.632,2.921; 27 3.632,3.581; 28 3.632,4.216
PCM2704C_PCM2707 = smd 0.47 x 1.2: 1 -2.8,-4; 2 -2,-4; 3 -1.2,-4; 4 -0.4,-4; 5 0.4,-4; 6 1.2,-4; 7 2,-4; 8 2.8,-4; 17 2.8,4; 18 2,4; 19 1.2,4; 20 0.4,4; 21 -0.4,4; 22 -1.2,4; 23 -2,4; 24 -2.8,4 | smd 1.2 x 0.47: 9 4,-2.8; 10 4,-2; 11 4,-1.2; 12 4,-0.4; 13 4,0.4; 14 4,1.2; 15 4,2; 16 4,2.8; 25 -4,2.8; 26 -4,2; 27 -4,1.2; 28 -4,0.4; 29 -4,-0.4; 30 -4,-1.2; 31 -4,-2; 32 -4,-2.8
AMP_TPA6120_TPA6120 = smd 0.5 x 2.2: 1 0.25,1.095; 2 1.52,1.095; 3 2.79,1.095; 4 4.06,1.095; 5 5.33,1.095; 6 6.6,1.095; 7 7.87,1.095; 8 9.14,1.095; 9 10.41,1.095; 10 11.68,1.095; 11 11.68,10.295; 12 10.41,10.295; 13 9.14,10.295; 14 7.87,10.295; 15 6.6,10.295; 16 5.33,10.295; 17 4.06,10.295; 18 2.79,10.295; 19 1.52,10.295; 20 0.25,10.295 | smd 3.81 x 2.79: 21 5.965,5.54
RK097 = drill 1: 1 2.5,0; 2 0,0; 3 -2.5,0; 4 2.5,-2.5; 5 0,-2.5; 6 -2.5,-2.5
STX3100 = drill 1.5 pad 2.54: 1 2.7,-0.1 | drill 1.5: 2 7.7,5; 3 7.7,2.3; 4 7.7,-2.5; 5 7.7,-5.2 | hole 1.5: 2.7,4.9; 2.7,-5.1; 7.7,-0.1

### Placement (x,y rotation side)
C1  114,82.91 90 top
C2  113.39,77.22 180 top
C3  78.84,84.53 180 top
C4  78.84,76.2 180 top
C5  39.83,83.31 90 top
C6  39.22,77.62 180 top
C7  93.68,87.99 270 top
C8  68.28,87.99 90 top
C9  105.26,84.12 270 top
C10  80.87,88.6 180 top
C11  110.54,84.73 90 top
C12  11.99,86.77 0 top
C13  11.99,88.6 180 bottom
C14  11.99,94.49 0 top
C15  11.99,92.66 180 bottom
C16  11.99,75.79 0 top
C17  11.99,68.07 0 top
C18  11.99,73.96 180 bottom
C19  11.99,69.9 180 bottom
C20  25.2,87.99 90 top
C21  43.89,87.99 270 top
C22  11.99,49.38 0 top
C23  11.99,57.1 0 top
C24  11.99,55.27 180 bottom
C25  11.99,51.21 180 bottom
C26  28.45,4.88 180 top
C27  25.2,4.88 180 top
C28  40.03,44.91 180 bottom
C29  40.44,56.08 180 bottom
C30  39.83,23.57 180 bottom
C31  39.83,35.56 180 bottom
C32  52.02,48.97 180 bottom
C33  52.22,33.12 180 bottom
C34  56.9,35.76 0 bottom
C35  56.69,51.61 0 bottom
C36  44.5,38.2 0 bottom
C37  44.5,26.21 0 bottom
C38  45.11,58.72 0 bottom
C39  44.7,47.55 0 bottom
C40  53.04,83.31 90 top
C41  52.43,77.62 180 top
C42  71.32,31.9 270 top
C43  76,24.99 0 top
C44  71.12,47.75 270 top
C45  75.79,40.84 0 top
C46  96.11,54.86 0 top
C47  96.11,36.98 0 top
C48  36.37,85.14 90 top
C49  49.58,85.14 90 top
C50  54.25,46.53 180 top
C51  32.51,9.35 270 top
C52  35.6,4.43 45 top
C53  42.88,31.9 0 top
C54  42.88,19.91 0 top
C55  43.48,52.43 0 top
C56  43.08,41.25 0 top
C57  55.27,29.46 0 top
C58  55.07,45.31 0 top
C59  42.06,21.13 180 top
C60  42.06,33.12 180 top
C61  42.67,53.64 180 top
C62  42.27,42.47 180 top
C63  54.46,30.68 180 top
C64  48.97,47.75 0 top
C65  49.17,31.9 0 top
C66  72.95,49.99 180 top
C67  73.15,34.14 180 top
C68  96.11,31.29 0 top
C69  96.11,13.41 0 top
C70  116.64,38.2 0 top
C71  116.64,28.04 0 top
C72  110.54,38.2 270 top
C73  110.54,27.84 270 top
C74  97.33,43.28 0 bottom
C75  97.33,48.56 180 bottom
C76  97.33,24.99 180 bottom
C77  97.33,19.71 0 bottom
C78  99.97,50.19 0 top
C79  99.97,41.66 0 top
C80  99.97,26.62 0 top
C81  99.97,18.08 0 top
C82  22.56,55.88 0 top
C83  23.16,31.29 0 top
C84  9.55,38.4 90 top
C85  22.76,51.82 180 top
C86  22.76,35.15 180 top
C87  13.82,39.22 270 top
C88  31.29,45.92 90 top
C89  31.29,40.23 270 top
C90  25.4,42.47 90 bottom
C91  54.86,62.38 0 top
C92  53.44,21.13 0 top
C93  48.97,62.38 90 top
C94  48.36,20.93 90 top
C95  65.23,35.36 270 top
C96  65.02,51.21 270 top
C97  23.37,22.76 180 top
C98  30.28,22.76 0 top
C99  19.3,10.78 90 top
C100  118.06,75.59 180 top
C101  82.7,76.81 180 top
C102  43.89,76 180 top
C103  57.1,76 180 top
C104  44.09,83.31 0 top
C105  57.3,83.31 0 top
C106  118.26,82.91 0 top
C107  82.91,84.12 0 top
C108  52.43,76 180 top
C109  52.43,74.37 180 top
C110  52.43,72.75 180 top
C111  52.43,71.12 180 top
C112  39.22,76 180 top
C113  39.22,74.37 180 top
C114  39.22,72.75 180 top
C115  39.22,71.12 180 top
C116  113.39,75.59 180 top
C117  113.39,73.96 180 top
C118  113.39,72.34 180 top
C119  113.39,70.71 180 top
C120  84.33,61.37 270 top
C121  73.36,61.37 270 top
C123  128.22,68.07 90 top  (outside the outline)
C124  84.33,69.29 270 top
C125  73.36,69.29 270 top
CN1  3.86,8.53 270 top
IC1  74.37,45.31 180 top
IC2  74.57,29.46 180 top
L1  12.19,13 180 top
LED_DAC  4.06,24.38 0 top
LED_MUTE  4.06,19.71 0 top
LED_PWR  4.06,29.06 0 top
OA1  42.27,46.94 270 top
OA2  42.67,58.12 270 top
OA3  42.06,25.6 270 top
OA4  42.06,37.59 270 top
OA5  54.25,51 270 top
OA6  54.46,35.15 270 top
Q1  26.82,19.3 180 top
R1  118.06,74.37 0 top
R2  99.57,53.24 0 top
R3  120.5,75.59 0 top
R4  82.7,75.59 0 top
R5  99.57,38.61 0 top
R6  85.14,76.81 0 top
R7  43.89,74.78 0 top
R8  99.57,29.67 0 top
R9  46.33,76 0 top
R10  57.1,74.78 0 top
R11  99.57,15.04 0 top
R12  59.54,76 0 top
R13  48.97,50.19 0 top
R14  48.97,51.82 0 top
R15  49.17,34.34 0 top
R16  49.17,35.97 0 top
R17  24.18,16.05 0 top
R18  10.79,8.14 180 top
R19  10.79,9.8 180 top
R20  42.06,22.35 0 top
R21  42.06,34.34 0 top
R22  42.67,54.86 0 top
R23  42.27,43.69 0 top
R24  54.25,47.75 0 top
R25  54.46,31.9 0 top
R26  49.17,33.12 180 top
R27  48.97,48.97 180 top
R28  72.95,51.21 0 top
R29  60.76,45.92 90 top
R30  72.95,52.43 180 top
R31  73.15,35.36 0 top
R32  60.96,30.07 90 top
R33  73.15,36.58 180 top
R35  71.12,45.31 90 top
R37  71.32,29.46 90 top
R38  91.85,39.42 180 top
R39  91.85,28.85 180 top
R40  91.85,52.43 180 top
R41  94.49,52.43 180 top
R42  94.49,39.42 180 top
R43  91.85,15.85 180 top
R44  94.49,28.85 180 top
R45  94.49,15.85 180 top
R46  96.11,53.64 180 top
R47  93.68,53.64 0 top
R48  93.68,38.2 0 top
R49  96.11,38.2 180 top
R50  96.11,30.07 180 top
R51  93.68,30.07 0 top
R52  93.68,14.63 0 top
R53  96.11,14.63 180 top
R54  27.71,42.09 180 top
R55  26.82,16.05 0 top
R57  7.72,29.06 0 top
R58  7.72,24.38 0 top
R59  7.72,19.71 0 top
R60  10.78,6.69 180 top
R61  82.91,8.13 0 top
R62  80.47,8.13 180 top
R63  80.47,8.13 0 bottom
R64  82.91,8.13 180 bottom
RECT1  11.99,53.24 270 top
RECT2  11.99,90.63 270 top
RECT3  11.99,71.93 270 top
REG3V3  43.89,79.65 0 top
REG5V  57.1,79.65 0 top
REG_NEG  82.7,80.47 0 top
REG_POS  118.06,79.25 0 top
S1  69.7,3.66 0 top
S2  45.11,3.66 0 top
S3  15.44,23.98 180 top
S4  81.69,3.66 0 top
U1  21.74,43.48 0 top
U$3  26.82,10.57 90 top
U$4  98.55,51.61 180 top
U$5  98.55,28.04 180 top
U$10  95.91,4.88 180 top
X1  57.71,-0.41 90 top
X2  115.01,-0.41 90 top

### Tracks (layer width: path | path; a pad name or v marks a point on that pad's centre or on a via)
3.3V  (via drill 0.6)  (15 unrouted)
  Top 0.305: C102.P$2 R7.P$1 | U$3.21 21.55,10.17 21.34,9.96 19.38,9.96 C99.P$1 | U1.9 14.58,42.52 C87.1 | C84.+ 9.55,41.25 9.96,41.66
  other vias: 41.45,71.12 41.45,72.54 41.45,73.96 41.45,75.39 41.45,76.81
  pour Top (no thermals): 41.96,78.44 39.42,78.44 39.42,70.31 42.67,70.31 42.67,77.72 41.96,77.72
  pour Top (no thermals): 43.38,76.4 42.27,76.4 41.86,76 41.05,76 40.84,75.79 40.84,74.98 41.05,74.78 41.76,74.78 42.27,74.27 43.38,74.27
5V  (via drill 0.6)  (7 unrouted)
  Top 0.305: C103.P$2 R10.P$1 | U1.28 25.38,51.74 C85.1 25.3,53.14 23.98,54.46 23.98,55.83 C82.+ | U1.15 25.38,35.23 C86.1 25.3,33.43 24.59,32.72 24.59,31.34 C83.+
  other vias: 54.66,71.12 54.66,72.54 54.66,73.96 54.66,75.39 54.66,76.81
  pour Top (no thermals): 55.17,78.44 52.63,78.44 52.63,70.31 55.88,70.31 55.88,77.72 55.17,77.72
  pour Top (no thermals): 56.59,76.4 55.47,76.4 55.07,76 54.25,76 54.05,75.79 54.05,74.98 54.25,74.78 54.97,74.78 55.37,74.37 56.59,74.37
6V3_RAW  (via drill 0.33)  (4 unrouted)
  Top 0.305: C22.2 14.43,49.38 15.04,49.99 15.04,51 RECT1.1 12.46,51.14 11.99,51.61 11.99,53.03 v13.01,54.05
  Bottom 0.305: C24.2 12.94,54.12 v13.01,54.05
  pour Top (no thermals): 48.16,83.31 55.98,83.31 55.98,81.58 55.17,81.58 55.17,80.77 48.16,80.77
  pour Top (no thermals): 42.77,81.58 41.96,81.58 41.96,80.77 34.95,80.77 34.95,83.31 42.77,83.31
AMP_CAP_L
  Top 0.254: C96.P$2 R28.P$1 R30.P$2
AMP_CAP_R
  Top 0.254: C95.P$2 R31.P$1 R33.P$2
AMP_IN_L
  Top 0.254: IC1.3 73.74,49.95 C66.P$1 R28.P$2
AMP_IN_R
  Top 0.254: IC2.3 73.94,34.1 C67.P$1 R31.P$2
AMP_L
  Top 0.254: C96.P$1 60.76,50.89 R29.P$2 60.82,46.74 61.77,46.74 63.8,44.7 63.8,17.88 70.71,10.97 70.71,3.45 69.7,2.44 S1.5
AMP_OUT_L  (via drill 0.33)
  Top 0.254: R35.P$1 73.29,44.56 73.74,44.12 IC1.6 73.76,42.69 73.76,39.83 74.17,39.42 76.61,39.42 78.44,37.59 78.44,23.37 82.91,18.9 82.91,14.63 84.12,13.41 v84.94,13.41
  Bottom 0.254: U$10.6 98.41,9.49 97.54,10.36 87.99,10.36 v84.94,13.41
AMP_OUT_R  (via drill 0.33)
  Top 0.254: R37.P$1 73.5,28.71 73.94,28.27 IC2.6 73.94,22.58 75.39,21.13 79.65,21.13 82.3,18.49 82.3,14.43 83.92,12.8 84.53,12.8 v84.73,12.6
  Bottom 0.254: v84.73,12.6 87.58,9.75 95.91,9.75 97.13,8.53 97.13,6.16 U$10.3
AMP_R
  Top 0.254: C95.P$1 60.96,35.04 R32.P$2 61.02,30.89 61.98,30.89 62.99,29.87 62.99,17.48 69.7,10.77 S1.2
BCK  (via drill 0.33)
  Top 0.254: U$3.19 21.56,11.77 19.91,13.41 19.91,21.13 18.09,22.96 18.09,31.29 16.87,32.51 7.72,32.51 5.28,34.95 5.28,42.67 v5.69,43.08 | U1.6 9.09,44.45 v8.94,44.3
  Bottom 0.254: v5.69,43.08 6.3,43.08 7.52,44.3 v8.94,44.3
BUF_L  (1 unrouted)
  Top 0.254: U$10.5 95.91,10.36 94.89,11.38 89.2,11.38 85.34,15.24 85.34,36.58 88.19,39.42 R38.P$2
BUF_R  (1 unrouted)
  Top 0.254: U$10.2 97.13,6.1 97.13,11.18 96.32,11.99 93.27,11.99 91.03,14.22 91.03,15.79 R43.P$2
BUFINL_L
  Top 0.254: R40.P$1 93.07,52.43 93.27,52.43 | 93.27,52.43 R41.P$2 93.27,52.43 | U$4.5 93.22,52.38 93.27,52.43
BUFINL_R
  Top 0.254: R38.P$1 93.27,39.42 | U$4.16 93.22,39.47 93.27,39.42 | 93.27,39.42 R42.P$2
BUFINR_L  (2 unrouted)
BUFINR_R  (2 unrouted)
BUFL_L+
  Top 0.254: U$4.4 94.49,53.58 R47.P$2 R46.P$2 C46.P$1
BUFL_R+
  Top 0.254: U$4.17 94.49,38.27 R48.P$2 R49.P$2 C47.P$1
BUFOUTL_L  (1 unrouted)
  Top 0.254: U$4.2 97.03,52.15 R2.P$1
BUFOUTL_R  (1 unrouted)
  Top 0.254: U$4.19 97.03,39.69 R5.P$1
BUFOUTR_L  (2 unrouted)
BUFOUTR_R  (2 unrouted)
BUFR_L+  (3 unrouted)
BUFR_R+  (3 unrouted)
D+
  Top 0.254: R18.P$1 11.54,8.39 11.76,8.61 22.78,8.61 U$3.23
D-
  Top 0.254: R19.P$1 11.54,9.59 11.82,9.31 22.77,9.31 U$3.22
DATA
  Top 0.254: U$3.17 21.99,13.37 21.13,14.22 21.13,21.54 19.3,23.37 19.3,31.9 17.48,33.73 8.53,33.73 6.5,35.76 6.5,42.88 8.74,45.11 U1.5
GAIN_L
  Top 0.254: IC1.2 75.01,46.76 74.31,46.06 R35.P$2 71.06,46.13 65.84,46.13 64.41,44.7 64.41,18.49 71.53,11.38 80.06,11.38 81.22,10.22 R62.P$1 R61.P$1
GAIN_R  (via drill 0.33)
  Top 0.254: IC2.2 75.21,30.91 74.51,30.21 R37.P$2 71.26,30.28 65.43,30.28 65.02,29.87 65.02,19.1 72.14,11.99 80.47,11.99 v81.08,11.38
  Bottom 0.254: R64.P$1 R63.P$1 81.22,11.24 v81.08,11.38
GAINL_1
  Top 0.254: S4.1 79.22,4.9 78.64,5.49 78.64,7.52 79.25,8.13 R62.P$2
GAINL_2
  Top 0.254: S4.3 84.15,4.9 84.73,5.49 84.73,7.52 84.12,8.13 R61.P$2
GAINR_1
  Bottom 0.254: S4.4 79.27,2.41 78.64,3.05 78.64,7.52 79.25,8.13 R63.P$2
GAINR_2
  Bottom 0.254: S4.6 84.1,2.41 84.73,3.05 84.73,7.52 84.12,8.13 R64.P$2
GND  (via drill 0.33)  (172 unrouted)
  Top 0.305: C23.2 14.43,57.1 15.04,56.49 15.04,55.48 RECT1.4 14.9,53.3 14.22,52.63 13.21,52.63 v13.01,52.43 | C14.2 14.02,94.49 14.9,93.61 RECT2.4 14.9,90.69 14.22,90.02 13.21,90.02 v13.01,89.81 | C17.2 14.02,68.07 14.9,68.95 RECT3.1 12.46,69.83 11.99,70.31 11.99,71.73 v13.01,72.75
  Bottom 0.305: C25.2 12.94,52.36 v13.01,52.43 | C13.2 12.94,89.75 v13.01,89.81 | v13.01,72.75 13.01,73.9 C18.2
  pour Top (no thermals): 74.98,72.95 82.7,72.95 82.7,57.71 74.98,57.71
HP_IN_L
  Bottom 0.254: X1.5 62.91,7.43 64.21,8.74 68.89,8.74 70.71,6.91 70.71,3.4 S1.6
HP_IN_R
  Bottom 0.254: X1.2 52.71,8.41 53.65,9.35 69.7,9.35 71.73,7.32 71.73,4.93 S1.3
HP_OUT_L  (2 unrouted)
HP_OUT_R  (2 unrouted)
IOUTL+
  Top 0.254: U1.25 27.89,45.77 28.04,45.92 34.95,45.92 36.58,47.55 39.54,47.55 OA1.2
  Top 0.406: OA1.2 40.82,47.57 41.52,46.88 R23.P$1 C62.P$2
IOUTL-
  Top 0.254: U1.26 27.1,46.41 27.43,46.74 27.43,54.25 31.9,58.73 39.95,58.73 OA2.2
  Top 0.406: OA2.2 41.22,58.75 41.92,58.05 R22.P$1 C61.P$2
IOUTR+
  Top 0.254: U1.17 27.1,40.56 28.04,39.62 28.04,32.92 34.75,26.21 39.34,26.21 OA3.2
  Top 0.406: OA3.2 40.62,26.24 41.31,25.54 R20.P$1 C59.P$2
IOUTR-
  Top 0.254: U1.18 27.48,41.2 28.45,40.23 35.76,40.23 37.8,38.2 39.34,38.2 OA4.2
  Top 0.406: OA4.2 40.62,38.23 41.31,37.53 R21.P$1 C60.P$2
IVOUT_L-
  Top 0.254: R14.P$1 48.22,56.22 46.94,57.51 45.4,57.51 OA2.6
  Top 0.406: OA2.6 44.48,57.48 43.42,56.43 R22.P$2 C61.P$1
IVOUT_R-
  Top 0.254: OA4.6 46.35,36.96 47.35,35.97 R16.P$1
  Top 0.406: OA4.6 43.87,36.96 42.81,35.9 R21.P$2 C60.P$1
IVOUTR+
  Top 0.254: OA3.6 45.9,24.97 46.74,25.81 46.74,33.53 47.55,34.34 R15.P$1
  Top 0.406: OA3.6 43.87,24.97 42.81,23.91 R20.P$2 C59.P$1
IVUOT_L+
  Top 0.254: OA1.6 46.1,46.3 46.74,46.94 46.74,49.78 47.14,50.19 R13.P$1
  Top 0.406: OA1.6 44.07,46.3 43.02,45.25 R23.P$2 C62.P$1
LRCK  (via drill 0.33)
  Top 0.254: U$3.5 29.88,10.97 v29.67,11.18 | U1.4 18.06,45.72 8.33,45.72 6.5,43.89 5.49,43.89 4.67,43.08 4.67,34.54 7.32,31.9 16.46,31.9 17.48,30.89 17.48,22.55 19.3,20.73 19.3,13.01 v20.73,11.58
  Bottom 0.254: v29.67,11.18 21.13,11.18 v20.73,11.58
MUTE  (1 unrouted)
N$1
  Top 0.305: REG5V.3 57.1,76 C103.P$1 | R12.P$1 C103.P$1 | C103.P$1 R10.P$2
N$2
  Top 0.305: REG_POS.3 118.06,75.59 C100.P$1 | R3.P$1 C100.P$1 | C100.P$1 R1.P$2
N$3  (via drill 5.08)
  other vias: 5.08,67.26
N$4  (1 unrouted)
N$5  (1 unrouted)
N$6  (via drill 5.08)
  other vias: 5.08,76.61
N$7
  Top 0.305: REG_NEG.3 82.7,77.01 82.91,76.81 C101.P$1 | C101.P$1 R4.P$2 | R6.P$1 C101.P$1
N$8  (via drill 5.08)
  other vias: 5.08,48.56
N$9
  pour Top: 9.14,9.96 9.14,10.77 11.18,10.77 11.18,14.22 9.14,14.22 9.14,11.58 6.71,11.58 6.71,9.96
N$10  (via drill 5.08)
  other vias: 5.08,57.91
N$12  (via drill 0.33)
  Top 0.305: v9.14,89.81 9.14,88.59 RECT2.2 8.94,88.39 9.14,88.39 9.14,87.58 9.96,86.77 C12.1
  Bottom 0.305: C13.1 10.36,88.59 v9.14,89.81
N$13  (via drill 0.33)
  Top 0.305: v9.14,91.44 9.14,92.66 RECT2.3 9.14,92.79 9.14,93.67 9.96,94.49 C14.1
  Bottom 0.305: C15.1 10.36,92.66 v9.14,91.44
N$17
  Top 0.305: REG3V3.3 43.89,76 C102.P$1 | R9.P$1 C102.P$1 | C102.P$1 R7.P$2
N$23  (via drill 0.33)
  Top 0.305: C23.1 9.96,57.1 9.08,56.22 RECT1.3 9.08,54.12 v9.14,54.05
  Bottom 0.305: C24.1 10.36,55.27 v9.14,54.05
N$24  (via drill 0.33)
  Top 0.305: C22.1 9.96,49.38 9.08,50.26 RECT1.2 9.08,52.36 v9.14,52.43
  Bottom 0.305: C25.1 10.36,51.21 v9.14,52.43
N$32  (1 unrouted)
N$33
  Top 0.254: U$3.15 24.82,15.94 R17.P$2
N$51
  Top 0.305: REG_NEG.14 82.05,84.02 C107.P$1
N$52
  Top 0.305: REG_POS.14 117.41,82.8 C106.P$1
N$54
  Top 0.305: REG3V3.14 43.24,83.21 C104.P$1
N$55
  Top 0.305: REG5V.14 56.45,83.21 C105.P$1
N$58  (via drill 5.08)
  other vias: 5.08,85.95
N$60  (via drill 5.08)
  other vias: 5.08,95.3
N$72  (via drill 0.33)
  Top 0.305: C16.1 9.96,75.79 9.08,74.92 RECT3.3 9.14,73.97 v9.14,72.75
  Bottom 0.305: C18.1 10.36,73.97 v9.14,72.75
N$77  (via drill 0.33)
  Top 0.305: C17.1 9.96,68.07 9.08,68.95 RECT3.2 9.14,69.9 v9.14,71.12
  Bottom 0.305: C19.1 10.36,69.9 v9.14,71.12
N$78
  Top 0.254: U1.21 28.78,43.16 30.48,41.45 31.7,41.45 31.9,41.66 31.39,41.66 C89.-
N$79
  Top 0.254: U1.22 26.54,43.81 27.03,44.3 31.19,44.3 C88.-
N$80
  Top 0.254: U$3.12 27.22,15.7 R55.P$2 27.57,18.63 28.25,19.3 Q1.1 29.36,22.59 C98.P$1
N$82
  Top 0.254: U$3.13 26.42,15.7 R55.P$1 26.07,18.63 25.4,19.3 Q1.2 24.28,22.59 C97.P$1
N$83  (1 unrouted)
N$84
  Top 0.254: U1.20 26.94,42.52 R54.P$2
OA1_COMP
  Top 0.406: OA1.5 44.22,45.03 43.83,44.64 C56.P$2
OA1_COMPBAL
  Top 0.406: OA1.8 43.16,48.84 42.33,48.02 C56.P$1
OA2_COMP
  Top 0.406: OA2.5 44.63,56.21 44.23,55.82 C55.P$2
OA2_COMPBAL
  Top 0.406: OA2.8 43.56,60.02 42.73,59.19 C55.P$1
OA3_COMP
  Top 0.406: OA3.5 44.02,23.7 43.62,23.3 C54.P$2
OA3_COMPBAL
  Top 0.406: OA3.8 42.95,27.51 42.12,26.68 C54.P$1
OA4_COMP
  Top 0.406: OA4.5 44.02,35.69 43.62,35.29 C53.P$2
OA4_COMPBAL
  Top 0.406: OA4.8 42.95,39.5 42.12,38.67 C53.P$1
OA5_COMP
  Top 0.406: OA5.5 56.21,49.1 55.82,48.7 C58.P$2
OA5_COMPBAL
  Top 0.406: OA5.8 55.14,52.91 54.32,52.08 C58.P$1
OA6_COMP
  Top 0.406: OA6.5 56.41,33.25 56.02,32.86 C57.P$2
OA6_COMPBAL
  Top 0.406: OA6.8 55.35,37.06 54.52,36.23 C57.P$1
PWR_EN_NEG  (1 unrouted)
PWR_EN_POS  (1 unrouted)
SCK  (via drill 0.33)
  Top 0.254: U$3.18 21.77,12.57 20.52,13.82 20.52,21.34 18.69,23.16 18.69,31.7 17.27,33.12 8.13,33.12 5.89,35.36 v5.89,41.86 | U1.7 9.68,43.81 9.35,43.48 v8.13,43.48
  Bottom 0.254: v8.13,43.48 7.52,43.48 v5.89,41.86
SEIN_L+
  Top 0.254: OA5.3 49.9,50.37 R13.P$2 R27.P$1 C64.P$2
SEIN_L-
  Top 0.254: OA5.2 49.9,51.64 R14.P$2
  Top 0.406: OA5.2 52.81,51.64 53.5,50.94 R24.P$1 C50.P$2
SEIN_R+
  Top 0.254: C65.P$2 R26.P$1 R15.P$2 50.1,34.52 OA6.3
SEIN_R-  (1 unrouted)
  Top 0.254: OA6.2 50.1,35.79 R16.P$2
  Top 0.406: OA6.2 53.01,35.79 53.71,35.09 R25.P$1
SEOUT_L
  Top 0.254: C50.P$1 55,46.19 55.07,46.13 55.07,43.08 58.73,39.42 58.73,20.52 68.68,10.57 68.68,3.4 S1.4
  Top 0.406: OA5.6 56.06,50.37 55,49.31 R24.P$2 C50.P$1
SEOUT_R
  Top 0.254: S1.1 67.69,10.34 57.91,20.12 57.91,26.21 55.27,28.85 55.27,30.62 C63.P$1
  Top 0.406: OA6.6 56.26,34.52 55.21,33.47 R25.P$2 C63.P$1
USB_D+
  Top 0.254: CN1.D+ 9.65,8.53 R18.P$2 10.04,6.71 R60.P$2
USB_D-
  Top 0.254: CN1.D- 9.57,9.33 R19.P$2
USB_VBUS  (1 unrouted)
V+_RAW  (via drill 0.33)  (3 unrouted)
  Top 0.305: C12.2 14.02,86.77 14.9,87.64 RECT2.1 12.46,88.53 11.99,89 11.99,90.42 v13.01,91.44
  Bottom 0.305: v13.01,91.44 13.01,92.59 C15.2
  pour Top (no thermals): 116.94,81.18 116.94,82.91 104.04,82.91 104.04,80.37 116.13,80.37 116.13,81.18
V-_RAW  (via drill 0.33)  (4 unrouted)
  Top 0.305: C16.2 14.02,75.79 14.9,74.92 RECT3.4 14.9,72 14.22,71.32 13.21,71.32 v13.01,71.12
  Bottom 0.305: v13.01,71.12 13.01,69.97 C19.2
  other vias: 79.45,82.91 80.67,82.91
  pour Top (no thermals): 81.58,82.4 81.58,85.55 78.84,85.55 78.84,81.58 80.77,81.58 80.77,82.4
VBUS  (4 unrouted)
VCC  (via drill 0.6)  (28 unrouted)
  Top 0.254: IC1.7 75.01,40.88 C45.P$1 | IC2.7 75.21,25.03 C43.P$1
  Top 0.305: C100.P$2 R1.P$1
  other vias: 115.62,76.4 115.62,74.98 115.62,73.56 115.62,72.14 115.62,70.71
  pour Top (no thermals): 116.13,78.03 113.59,78.03 113.59,69.9 116.84,69.9 116.84,77.32 116.13,77.32
  pour Top (no thermals): 117.55,76 116.64,76 116.23,75.59 115.21,75.59 115.01,75.39 115.01,74.57 115.21,74.37 116.03,74.37 116.43,73.96 117.55,73.96
VEE  (via drill 0.33)  (28 unrouted)
  Top 0.254: C42.P$1 72.08,32.65 IC2.4 | C44.P$1 71.88,48.5 IC1.4
  other vias: 79.45,78.03 80.67,78.03
  pour Top (no thermals): 81.58,78.64 81.58,77.22 82.19,77.22 82.19,75.18 78.84,75.18 78.84,79.35 80.77,79.35 80.77,78.64
(copper drawn outside any net)
  shapes: Bottom area x2